# Altium schematic sheet main_connectors.SchDoc
size A
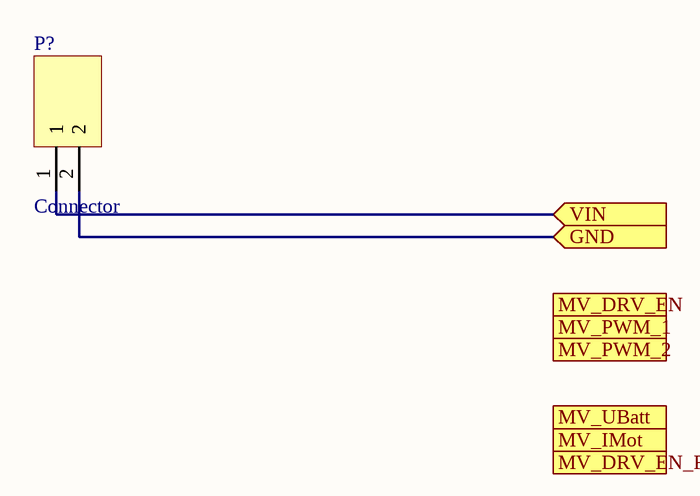
[diagram p0: main_connectors.SchDoc]

## Parts
P?  Connector  [FP_CONN2_TAP_254MM]

## Ports
GND (in), MV_DRV_EN (out), MV_DRV_EN_FB (in), MV_IMot (in), MV_PWM_1 (out), MV_PWM_2 (out), MV_UBatt (in), VIN (in)

## Nets
GND: P?.2 ; port GND
VIN: P?.1 ; port VIN

## Library data of the parts
P? = Connector_2pin: 2pin connector